# Altium project wifi-gps.PrjPcb
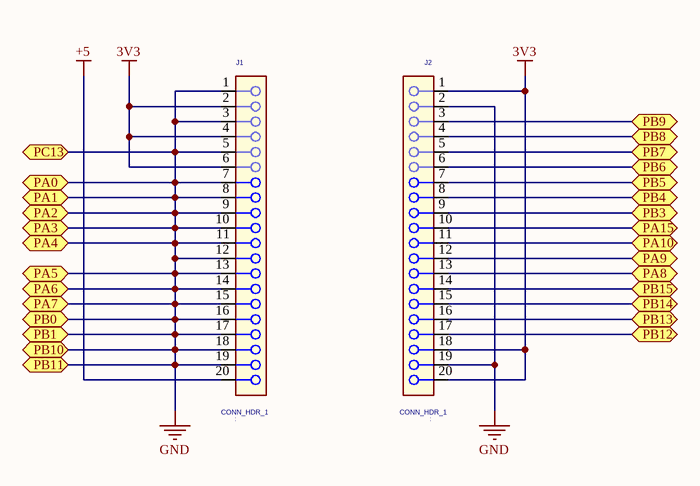
[diagram p0: wifi-gps.SchDoc]
1 sheet, 2 parts. Net scope: flat (ports and power ports of the same name join across sheets).

## Sheet wifi-gps.SchDoc
size A4; SheetNumber: 1; SheetTotal: 1

### Parts
J1  CONN_HDR_1  [SIP20-2P54-F]
J2  CONN_HDR_1  [SIP20-2P54-F]

### Ports
PA0 (bidir), PA1 (bidir), PA2 (bidir), PA3 (bidir), PA4 (bidir), PA5 (bidir), PA6 (bidir), PA7 (bidir), PA8 (bidir), PA9 (bidir), PA10 (bidir), PA15 (bidir), PB0 (bidir), PB1 (bidir), PB3 (bidir), PB4 (bidir), PB5 (bidir), PB6 (bidir), PB7 (bidir), PB8 (bidir), PB9 (bidir), PB10 (bidir), PB11 (bidir), PB12 (bidir), PB13 (bidir), PB14 (bidir), PB15 (bidir), PC13 (bidir)

### Nets
3V3: J1.2 J1.4 J1.6 J2.1 J2.18 J2.20
+5: J1.20
GND: J1.1 J1.3 J1.5 J1.7 J1.8 J1.9 J1.10 J1.11 J1.12 J1.13 J1.14 J1.15 J1.16 J1.17 J1.18 J1.19 J2.2 J2.19 ; port PC13, port PA0, port PA1, port PA2, port PA3, port PA4, port PA5, port PA6, port PA7, port PB0, port PB1, port PB10, port PB11
NetJ2_3: J2.3 ; port PB9
NetJ2_4: J2.4 ; port PB8
NetJ2_5: J2.5 ; port PB7
NetJ2_6: J2.6 ; port PB6
NetJ2_7: J2.7 ; port PB5
NetJ2_8: J2.8 ; port PB4
NetJ2_9: J2.9 ; port PB3
NetJ2_10: J2.10 ; port PA15
NetJ2_11: J2.11 ; port PA10
NetJ2_12: J2.12 ; port PA9
NetJ2_13: J2.13 ; port PA8
NetJ2_14: J2.14 ; port PB15
NetJ2_15: J2.15 ; port PB14
NetJ2_16: J2.16 ; port PB13
NetJ2_17: J2.17 ; port PB12

### Library data of the parts
J1 J2 = CMP-005-000000-1: CON 1X6 SKT TH 100MIL SP 344H AU 118L; AGILE_PN: 210-81616; CAD_APPROVED: Yes; MFG_PN01: 08001S3 0611-29RF; CLASS: IO; ASSY_OPT: DNP; MFG_NAME01: ANYTRONIC CORPORATION LIMITED; Temp_Range: -40°C to +105°C; Source: 野火_STM32F103C8T6核心板_V1.0_原理图封装库_AD格式.SCHLIB; ROHS: Yes; HEIGHT: 8.75MM; Design Item ID: CONN_HDR_1